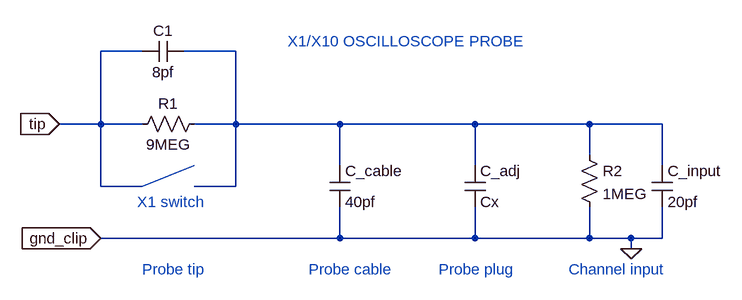
[diagram p0: schematic osc_probe.asc]
osc_probe.asc, the LTspice schematic file:
Version 4
SHEET 1 1040 680
WIRE 128 16 64 16
WIRE 272 16 192 16
WIRE 64 128 64 16
WIRE 64 128 0 128
WIRE 128 128 64 128
WIRE 272 128 272 16
WIRE 272 128 208 128
WIRE 432 128 272 128
WIRE 640 128 432 128
WIRE 816 128 640 128
WIRE 928 128 816 128
WIRE 816 176 816 128
WIRE 432 192 432 128
WIRE 640 192 640 128
WIRE 928 192 928 128
WIRE 64 224 64 128
WIRE 128 224 208 192
WIRE 128 224 64 224
WIRE 272 224 272 128
WIRE 272 224 208 224
WIRE 432 304 432 256
WIRE 432 304 64 304
WIRE 640 304 640 256
WIRE 640 304 432 304
WIRE 816 304 816 256
WIRE 816 304 640 304
WIRE 880 304 816 304
WIRE 928 304 928 256
WIRE 928 304 880 304
WIRE 880 320 880 304
FLAG 0 128 tip
IOPIN 0 128 In
FLAG 64 304 gnd_clip
IOPIN 64 304 In
FLAG 880 320 0
SYMBOL res 224 112 R90
WINDOW 0 0 56 VBottom 2
WINDOW 3 32 56 VTop 2
SYMATTR InstName R1
SYMATTR Value 9MEG
SYMBOL cap 192 0 R90
WINDOW 0 0 32 VBottom 2
WINDOW 3 32 32 VTop 2
SYMATTR InstName C1
SYMATTR Value 8pf
SYMBOL cap 416 192 R0
SYMATTR InstName C_cable
SYMATTR Value 40pf
SYMBOL cap 912 192 R0
SYMATTR InstName C_input
SYMATTR Value 20pf
SYMBOL res 800 160 R0
SYMATTR InstName R2
SYMATTR Value 1MEG
SYMBOL cap 624 192 R0
SYMATTR InstName C_adj
SYMATTR Value Cx
TEXT 120 248 Left 2 ;X1 switch
TEXT 128 352 Left 2 ;Probe tip
TEXT 384 352 Left 2 ;Probe cable
TEXT 784 352 Left 2 ;Channel input
TEXT 352 0 Left 2 ;X1/X10 OSCILLOSCOPE PROBE
TEXT 584 352 Left 2 ;Probe plug

The netlist it stands for:
* osc_probe.asc
R1 N001 tip 9MEG
C1 N001 tip 8pf
C_cable N001 0 40pf
C_input N001 0 20pf
R2 N001 0 1MEG
C_adj N001 0 Cx
* X1 switch
* Probe tip
* Probe cable
* Channel input
* X1/X10 OSCILLOSCOPE PROBE
* Probe plug
.backanno
.end